# Altium project LimeSDR-Micro_mPCIe_1v4.PrjPcb (part 2 of 10)
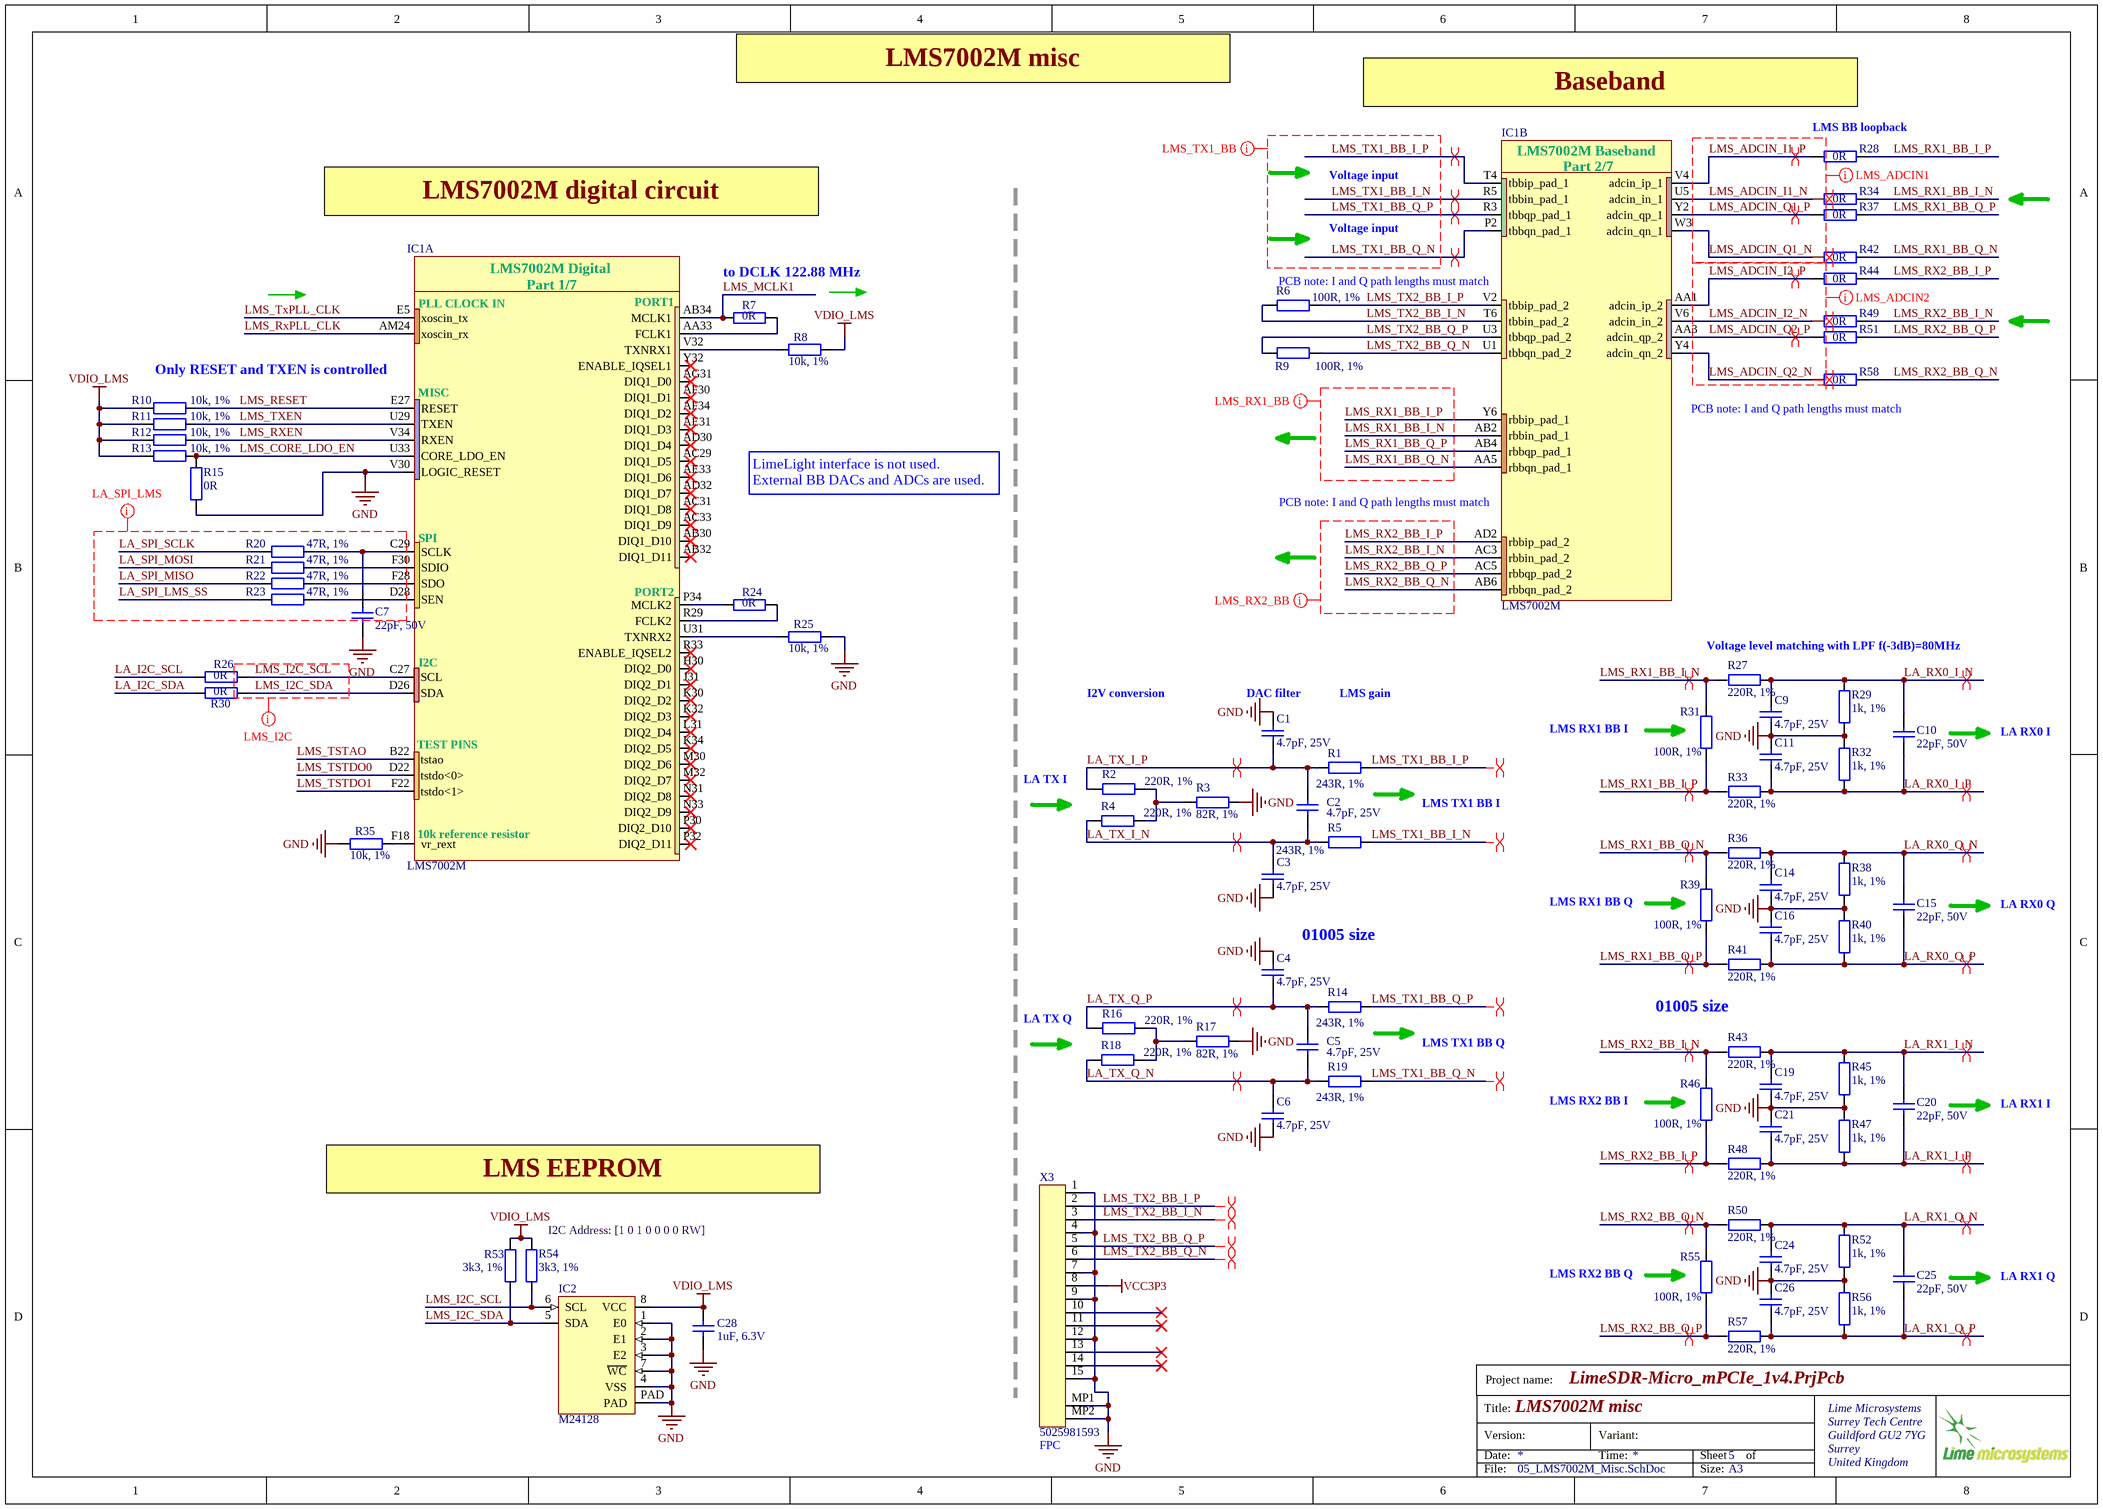
[diagram p10: 05_LMS7002M_Misc.SchDoc]

## Sheet 05_LMS7002M_Misc.SchDoc: LMS7002M misc (continued)

### Library data of the parts
C1-C4 C6 C9 = Cap_0402: Part Description: CAP CER 4.7PF 25V C0G/NP0 01005; Manufacturer: Murata; Manufacturer Part Number 1: GRM0225C1E4R7BA03L; Value: 4.7pF, 25V; Supplier 1: Digi-Key; Supplier Part Number 1: 490-13585-1-ND; Stock 1: 72879; Pricing 1: 1=0,1, 10=0,046, 50=0,0266, 100=0,0206, 500=0,0155, 1000=0,01218, 2500=0,01107, 5000=0,01019 (USD); RoHS: Yes; ComponentLink1URL: https://search.murata.co.jp/Ceramy/image/img/A01X/G101/ENG/GRM0225C1E4R7BA03-01.pdf?src-supplier=Digi-Key; ComponentLink1Description: https://search.murata.co.jp/Ceramy/image/img/A01X/G101/ENG/GRM0225C1E4R7BA03-01.pdf?src-supplier=Digi-Key; ComponentLink2URL: http://search.murata.co.jp/Ceramy/image/img/A01X/partnumbering_e_01.pdf?src-supplier=Digi-Key; ComponentLink2Description: http://search.murata.co.jp/Ceramy/image/img/A01X/partnumbering_e_01.pdf?src-supplier=Digi-Key
C5 C11 C14 C16 C19 C21 C24 C26 = Cap_0402: Manufacturer: Murata; Manufacturer Part Number 1: GRM0225C1E4R7BA03L; Part Description: CAP CER 4.7PF 25V C0G/NP0 01005; ComponentLink1Description: https://search.murata.co.jp/Ceramy/image/img/A01X/G101/ENG/GRM0225C1E4R7BA03-01.pdf?src-supplier=Digi-Key; ComponentLink1URL: https://search.murata.co.jp/Ceramy/image/img/A01X/G101/ENG/GRM0225C1E4R7BA03-01.pdf?src-supplier=Digi-Key; ComponentLink2Description: http://search.murata.co.jp/Ceramy/image/img/A01X/partnumbering_e_01.pdf?src-supplier=Digi-Key; ComponentLink2URL: http://search.murata.co.jp/Ceramy/image/img/A01X/partnumbering_e_01.pdf?src-supplier=Digi-Key; Pricing 1: 1=0,1, 10=0,046, 50=0,0266, 100=0,0206, 500=0,0155, 1000=0,01218, 2500=0,01107, 5000=0,01019 (USD); RoHS: Yes; Stock 1: 72879; Supplier 1: Digi-Key; Supplier Part Number 1: 490-13585-1-ND; Value: 4.7pF, 25V
C7 = Cap_0402: Manufacturer: Murata; Manufacturer Part Number 1: GRM0335C1H220JA01D; Part Description: 22 pF ±5% 50V Ceramic Capacitor C0G, NP0 0201 (0603 Metric); Tolerance: 5%; Dielectric: C0G; Value: 22pF, 50V; Supplier 1: Digi-Key; Supplier Part Number 1: 490-6123-1-ND; Stock 1: 2966748; Pricing 1: 1=0,10000, 10=0,01300, 50=0,00720, 100=0,00590, 500=0,00424, 1000=0,00333, 2500=0,00303, 5000=0,00279 (USD); RoHS: Yes; Mount: Surface Mount; Case/Package: 0201; Case Code (Metric): 0603; Case Code (Imperial): 0201; Min Operating Temperature: -55°C; Max Operating Temperature: 125°C; Package Quantity: 15000; Capacitance: 22pF; Voltage Rating: 50V; Packaging: Tape and Reel; Termination: SMD/SMT; Voltage: 50V; Voltage Rating (DC): 50V; Series: GRM; Length: 0.6mm; Width: 0.012inch; Height: 0.3mm; Thickness: 0.013inch; Depth: 0.3mm; Lead Free: Lead Free; RoHS Compliant: Yes; ComponentLink1URL: https://datasheet.ciiva.com/6271/partnumbering-e-01-6271146.pdf?src-supplier=Digi-Key; ComponentLink1Description: https://datasheet.ciiva.com/6271/partnumbering-e-01-6271146.pdf?src-supplier=Digi-Key; ComponentLink2URL: https://datasheet.ciiva.com/6271/partnumbering-e-01-6271143.pdf?src-supplier=Digi-Key; ComponentLink2Description: https://datasheet.ciiva.com/6271/partnumbering-e-01-6271143.pdf?src-supplier=Digi-Key; ComponentLink3URL: https://datasheet.ciiva.com/6271/partnumbering-e-01-6271149.pdf?src-supplier=Digi-Key; ComponentLink3Description: https://datasheet.ciiva.com/6271/partnumbering-e-01-6271149.pdf?src-supplier=Digi-Key
C10 = Cap_0402: Part Description: 22pF ±5% 50V C0G, NP0 Ceramic Capacitor -55°C ~ 125°C Surface Mount, MLCC 0402 (1005 Metric) 0.039" L x 0.020" W (1.00mm x 0.50mm); Manufacturer: Murata; Manufacturer Part Number 1: GRM0225C1H220JA02L; Dielectric: C0G; Tolerance: 5%; Value: 22pF, 50V; Supplier 1: Digi-Key; Supplier Part Number 1: 490-GRM0225C1H220JA02LCT-ND; Stock 1: 33525; Pricing 1: 1=0,1, 10=0,028, 50=0,016, 100=0,0125, 500=0,00938, 1000=0,00736, 2500=0,0067, 5000=0,00616 (USD); RoHS: Yes; Voltage Rating (DC): 50V; Capacitance: 22pF; Length: 400um; Width: 200um; Thickness: 200um; RoHS Compliant: Yes
C15 C20 C25 = Cap_0402: Manufacturer: Murata; Manufacturer Part Number 1: GRM0225C1H220JA02L; Part Description: 22pF ±5% 50V C0G, NP0 Ceramic Capacitor -55°C ~ 125°C Surface Mount, MLCC 0402 (1005 Metric) 0.039" L x 0.020" W (1.00mm x 0.50mm); Dielectric: C0G; Tolerance: 5%; Capacitance: 22pF; Length: 400um; Pricing 1: 1=0,1, 10=0,028, 50=0,016, 100=0,0125, 500=0,00938, 1000=0,00736, 2500=0,0067, 5000=0,00616 (USD); RoHS: Yes; RoHS Compliant: Yes; Stock 1: 33525; Supplier 1: Digi-Key; Supplier Part Number 1: 490-GRM0225C1H220JA02LCT-ND; Thickness: 200um; Value: 22pF, 50V; Voltage Rating (DC): 50V; Width: 200um
C28 = Cap_0402: Manufacturer: TDK Corporation; Manufacturer Part Number 1: JMK063ABJ105MP-F; Part Description: 1µF ±20% 6.3V X5R Ceramic Capacitor -55°C ~ 85°C Surface Mount, MLCC 0201 (0603 Metric) 0.024" L x 0.012" W (0.60mm x 0.30mm); Value: 1uF, 20%; Tolerance: ±20%; Capacitance: 1.0µF; Temperature Coefficient: X5R; Supplier 1: Digi-Key; Supplier Part Number 1: 587-5864-2-ND; Applications: General Purpose; Features: -; Lead Style: -; Ratings: -; Thickness (Max): -; Lead Spacing: -; Height - Seated (Max): -; Size / Dimension: 0.024" L x 0.012" W (0.60mm x 0.30mm); Mounting Type: Surface Mount, MLCC; Operating Temperature: -55°C ~ 85°C; Package / Case: 0201 (0603 Metric); Packaging: Cut Tape (CT); Voltage - Rated: 6.3V; Category: Capacitors; RoHS: RoHS Compliant
IC1 = LMS7002Mr4: Schematic symbol revision 4. Default footprint - 0.31mm pad; Manufacturer: Lime Microsystems; Part Description: IC FPRF Transceiver LMS7002M; 261 pin aQFN; Supplier 1: Lime Microsystems; Supplier Part Number 1: LMS7002M; Manufacturer Part Number 1: LMS7002M
IC2 = M24128-DFMC6TG: Manufacturer: STMicroelectronics; Part Description: EEPROM Memory IC 128Kb (16K x 8) I²C 1MHz 450ns 8-UFDFPN (2x3); Memory Type: Non-Volatile; Memory Format: EEPROM; Memory Size: 128Kb (16K x 8); Write Cycle Time - Word, Page: 5ms; Memory Interface: I²C; Voltage - Supply: 1.7 V ~ 5.5 V; Supplier 1: Digi-Key; Manufacturer Part Number 1: M24128-DFMC6TG; RoHS: RoHS Compliant; Category: Integrated Circuits (ICs); Stock 1: 5894; Pricing 1: 1=0.35, 10=0.348, 100=0.2854, 500=0.27748, 1000=0.27004 (USD); Packaging: Cut Tape (CT); Part Status: Active; Technology: EEPROM; Operating Temperature: -40°C ~ 85°C (TA); Mounting Type: Surface Mount; Package / Case: 8-UFDFN Exposed Pad; Supplier Device Package: 8-UFDFPN (2x3); ComponentLink1URL: http://www.st.com/content/ccc/resource/technical/document/datasheet/59/05/c9/5b/7b/41/48/b6/CD00259167.pdf/files/CD00259167.pdf/jcr:content/translations/en.CD00259167.pdf; ComponentLink1Description: http://www.st.com/content/ccc/resource/technical/document/datasheet/59/05/c9/5b/7b/41/48/b6/CD00259167.pdf/files/CD00259167.pdf/jcr:content/translations/en.CD00259167.pdf; Supplier Part Number 1: 497-15739-1-ND
R1 R5 R14 R19 = Res_0402: Part Description: RES 243 OHM 1% 1/32W 01005; Manufacturer: Yageo; Manufacturer Part Number 1: RC0100FR-07243RL; ComponentLink1URL: http://www.yageo.com/documents/recent/PYu-RC_Group_51_RoHS_L_7.pdf; ComponentLink1Description: http://www.yageo.com/documents/recent/PYu-RC_Group_51_RoHS_L_7.pdf; ComponentLink2URL: https://datasheet.ciiva.com/2560/pyu-r-int-thick-7-2560866.pdf?src-supplier=Digi-Key; ComponentLink2Description: https://datasheet.ciiva.com/2560/pyu-r-int-thick-7-2560866.pdf?src-supplier=Digi-Key; ComponentLink3URL: https://datasheet.ciiva.com/2560/pyu-r-int-thick-7-2560867.pdf?src-supplier=Digi-Key; ComponentLink3Description: https://datasheet.ciiva.com/2560/pyu-r-int-thick-7-2560867.pdf?src-supplier=Digi-Key; ComponentLink4URL: https://datasheet.ciiva.com/2560/pyu-r-int-thick-7-2560865.pdf?src-supplier=Digi-Key; ComponentLink4Description: https://datasheet.ciiva.com/2560/pyu-r-int-thick-7-2560865.pdf?src-supplier=Digi-Key; ComponentLink5URL: https://datasheet.ciiva.com/8887/pyu-rc0201-51-rohs-l-8-8887865.pdf?src-supplier=Avnet; ComponentLink5Description: https://datasheet.ciiva.com/8887/pyu-rc0201-51-rohs-l-8-8887865.pdf?src-supplier=Avnet; ComponentLink6Description: https://datasheet.ciiva.com/2471/pyu-rc0100-51-rohs-l-0-2471973.pdf?src-supplier=Digi-Key; ComponentLink6URL: https://datasheet.ciiva.com/2471/pyu-rc0100-51-rohs-l-0-2471973.pdf?src-supplier=Digi-Key; ComponentLink7Description: https://datasheet.ciiva.com/2471/pyu-rc0100-51-rohs-l-0-2471974.pdf?src-supplier=Digi-Key; ComponentLink7URL: https://datasheet.ciiva.com/2471/pyu-rc0100-51-rohs-l-0-2471974.pdf?src-supplier=Digi-Key; ComponentLink8Description: https://datasheet.ciiva.com/2471/pyu-rc0100-51-rohs-l-0-2471975.pdf?src-supplier=Digi-Key; ComponentLink8URL: https://datasheet.ciiva.com/2471/pyu-rc0100-51-rohs-l-0-2471975.pdf?src-supplier=Digi-Key; Value: 243R, 1%; Supplier 1: Digi-Key; Supplier Part Number 1: YAG6284CT-ND; Stock 1: 13300; Pricing 1: 1=0,24, 10=0,126, 50=0,0866, 100=0,0746, 500=0,05474, 1000=0,0485, 5000=0,03793, 10000=0,0347 (USD); RoHS: Yes; ComponentLink9URL: https://datasheet.octopart.com/RC0100FR-07243RL-Yageo-datasheet-164759695.pdf?src-supplier=Future+Electronics; ComponentLink9Description: https://datasheet.octopart.com/RC0100FR-07243RL-Yageo-datasheet-164759695.pdf?src-supplier=Future+Electronics; ComponentLink10URL: http://www.yageo.com.tw/exep/pages/download/literatures/PYu-R_INT-thick_7.pdf?src-supplier=Digi-Key; ComponentLink10Description: http://www.yageo.com.tw/exep/pages/download/literatures/PYu-R_INT-thick_7.pdf?src-supplier=Digi-Key; ComponentLink11URL: https://www.yageo.com/upload/media/product/productsearch/datasheet/rchip/PYu-RC_Group_51_RoHS_L_11.pdf?src-supplier=Digi-Key; ComponentLink11Description: https://www.yageo.com/upload/media/product/productsearch/datasheet/rchip/PYu-RC_Group_51_RoHS_L_11.pdf?src-supplier=Digi-Key
R2 R27 = Res_0402: Part Description: 220 Ohms ±1% 0.03W, 1/32W Chip Resistor 01005 (0402 Metric) Moisture Resistant Thick Film; Manufacturer: Yageo; Manufacturer Part Number 1: RC0100FR-07220RL; Max Power Dissipation: 30mW; Temperature Coefficient: 200ppm/°C; Value: 220R, 1%; Case Code (Imperial): 1005; Case Code (Metric): 0402; ComponentLink1Description: http://www.yageo.com.tw/exep/pages/download/literatures/PYu-R_INT-thick_7.pdf?src-supplier=Digi-Key; ComponentLink1URL: http://www.yageo.com.tw/exep/pages/download/literatures/PYu-R_INT-thick_7.pdf?src-supplier=Digi-Key; ComponentLink2Description: http://www.yageo.com/NewPortal/yageodocoutput?fileName=/pdf/R-Chip/PYu-RC_51_RoHS_P_0.pdf&src-supplier=Digi-Key; ComponentLink2URL: http://www.yageo.com/NewPortal/yageodocoutput?fileName=/pdf/R-Chip/PYu-RC_51_RoHS_P_0.pdf&src-supplier=Digi-Key; ComponentLink3Description: https://datasheet.ciiva.com/11819/0900766b80c66297-11819479.pdf?src-supplier=RSComponents; ComponentLink3URL: https://datasheet.ciiva.com/11819/0900766b80c66297-11819479.pdf?src-supplier=RSComponents; ComponentLink4Description: https://datasheet.ciiva.com/2519/pyu-r-int-thick-7-2519001.pdf?src-supplier=Digi-Key; ComponentLink4URL: https://datasheet.ciiva.com/2519/pyu-r-int-thick-7-2519001.pdf?src-supplier=Digi-Key; ComponentLink5Description: https://datasheet.ciiva.com/2519/pyu-r-int-thick-7-2519002.pdf?src-supplier=Digi-Key; ComponentLink5URL: https://datasheet.ciiva.com/2519/pyu-r-int-thick-7-2519002.pdf?src-supplier=Digi-Key; ComponentLink6Description: https://datasheet.ciiva.com/2519/pyu-r-int-thick-7-2519000.pdf?src-supplier=Digi-Key; ComponentLink6URL: https://datasheet.ciiva.com/2519/pyu-r-int-thick-7-2519000.pdf?src-supplier=Digi-Key; ComponentLink7Description: https://datasheet.ciiva.com/7849/1018594-7849983.pdf?src-supplier=Element14; ComponentLink7URL: https://datasheet.ciiva.com/7849/1018594-7849983.pdf?src-supplier=Element14; ComponentLink8Description: https://datasheet.ciiva.com/7849/1018594-7849982.pdf?src-supplier=Element14; ComponentLink8URL: https://datasheet.ciiva.com/7849/1018594-7849982.pdf?src-supplier=Element14; ComponentLink9Description: https://datasheet.ciiva.com/8889/pyu-rc0402-51-rohs-l-6-8889306.pdf?src-supplier=Avnet; ComponentLink9URL: https://datasheet.ciiva.com/8889/pyu-rc0402-51-rohs-l-6-8889306.pdf?src-supplier=Avnet; ComponentLink10Description: https://datasheet.ciiva.com/16741/pyu-rc0402-51-rohs-l-6-r-16741016.pdf?src-supplier=Future+Electronics; ComponentLink10URL: https://datasheet.ciiva.com/16741/pyu-rc0402-51-rohs-l-6-r-16741016.pdf?src-supplier=Future+Electronics; ComponentLink11Description: https://datasheet.ciiva.com/15189/getdatasheetpartid-325130-15189445.pdf?src-supplier=Verical; ComponentLink11URL: https://datasheet.ciiva.com/15189/getdatasheetpartid-325130-15189445.pdf?src-supplier=Verical; ComponentLink12Description: https://datasheet.ciiva.com/22730/1678782-22730431.pdf?src-supplier=Element14; ComponentLink12URL: https://datasheet.ciiva.com/22730/1678782-22730431.pdf?src-supplier=Element14; ComponentLink13Description: https://datasheet.ciiva.com/24056/aoa0000ce2-24056777.pdf?src-supplier=Mouser; ComponentLink13URL: https://datasheet.ciiva.com/24056/aoa0000ce2-24056777.pdf?src-supplier=Mouser; Features: Moisture Resistant; Height: 0.006inch; Length: 0.016inch; Max Operating Temperature: 125°C; Min Operating Temperature: -55°C; Number of Terminations: 2; Packaging: Tape and Reel; Pricing 1: 1=0,24, 10=0,126, 50=0,0866, 100=0,0746, 500=0,05474, 1000=0,0485, 5000=0,03793, 10000=0,0347 (USD); Resistance: 220R; RoHS: Yes; RoHS Compliant: Yes; Series: RC; Stock 1: 17268; Supplier 1: Digi-Key; Supplier Part Number 1: YAG6275CT-ND; Tolerance: 1%; Width: 0.008inch
R3 R17 = Res_0402: Part Description: RES SMD 82 OHM 1% 1/32W 01005; Manufacturer: Cyntec; Manufacturer Part Number 1: PFR02S-820-FNH; Value: 82R, 1%; Supplier 1: DigiKey; Supplier Part Number 1: 2037-PFR02S-820-FNHCT-ND; Stock 1: 53991; Pricing 1: 1=0,1, 10=0,024, 50=0,015, 100=0,0125, 500=0,00848, 1000=0,00731, 5000=0,00531, 10000=0,00471 (USD)
R4 R16 R18 R33 R36 R41 R43 R48 R50 R57 = Res_0402: Manufacturer: Yageo; Manufacturer Part Number 1: RC0100FR-07220RL; Part Description: 220 Ohms ±1% 0.03W, 1/32W Chip Resistor 01005 (0402 Metric) Moisture Resistant Thick Film; Max Power Dissipation: 30mW; Temperature Coefficient: 200ppm/°C; Case Code (Imperial): 1005; Case Code (Metric): 0402; Features: Moisture Resistant; Height: 0.006inch; Length: 0.016inch; Max Operating Temperature: 125°C; Min Operating Temperature: -55°C; Number of Terminations: 2; Packaging: Tape and Reel; Pricing 1: 1=0,24, 10=0,126, 50=0,0866, 100=0,0746, 500=0,05474, 1000=0,0485, 5000=0,03793, 10000=0,0347 (USD); Resistance: 220R; RoHS: Yes; RoHS Compliant: Yes; Series: RC; Stock 1: 17268; Supplier 1: Digi-Key; Supplier Part Number 1: YAG6275CT-ND; Tolerance: 1%; Value: 220R, 1%; Width: 0.008inch; ComponentLink1Description: http://www.yageo.com.tw/exep/pages/download/literatures/PYu-R_INT-thick_7.pdf?src-supplier=Digi-Key; ComponentLink1URL: http://www.yageo.com.tw/exep/pages/download/literatures/PYu-R_INT-thick_7.pdf?src-supplier=Digi-Key; ComponentLink2Description: http://www.yageo.com/NewPortal/yageodocoutput?fileName=/pdf/R-Chip/PYu-RC_51_RoHS_P_0.pdf&src-supplier=Digi-Key; ComponentLink2URL: http://www.yageo.com/NewPortal/yageodocoutput?fileName=/pdf/R-Chip/PYu-RC_51_RoHS_P_0.pdf&src-supplier=Digi-Key; ComponentLink3Description: https://datasheet.ciiva.com/11819/0900766b80c66297-11819479.pdf?src-supplier=RSComponents; ComponentLink3URL: https://datasheet.ciiva.com/11819/0900766b80c66297-11819479.pdf?src-supplier=RSComponents; ComponentLink4Description: https://datasheet.ciiva.com/2519/pyu-r-int-thick-7-2519001.pdf?src-supplier=Digi-Key; ComponentLink4URL: https://datasheet.ciiva.com/2519/pyu-r-int-thick-7-2519001.pdf?src-supplier=Digi-Key; ComponentLink5Description: https://datasheet.ciiva.com/2519/pyu-r-int-thick-7-2519002.pdf?src-supplier=Digi-Key; ComponentLink5URL: https://datasheet.ciiva.com/2519/pyu-r-int-thick-7-2519002.pdf?src-supplier=Digi-Key; ComponentLink6Description: https://datasheet.ciiva.com/2519/pyu-r-int-thick-7-2519000.pdf?src-supplier=Digi-Key; ComponentLink6URL: https://datasheet.ciiva.com/2519/pyu-r-int-thick-7-2519000.pdf?src-supplier=Digi-Key; ComponentLink7Description: https://datasheet.ciiva.com/7849/1018594-7849983.pdf?src-supplier=Element14; ComponentLink7URL: https://datasheet.ciiva.com/7849/1018594-7849983.pdf?src-supplier=Element14; ComponentLink8Description: https://datasheet.ciiva.com/7849/1018594-7849982.pdf?src-supplier=Element14; ComponentLink8URL: https://datasheet.ciiva.com/7849/1018594-7849982.pdf?src-supplier=Element14; ComponentLink9Description: https://datasheet.ciiva.com/8889/pyu-rc0402-51-rohs-l-6-8889306.pdf?src-supplier=Avnet; ComponentLink9URL: https://datasheet.ciiva.com/8889/pyu-rc0402-51-rohs-l-6-8889306.pdf?src-supplier=Avnet; ComponentLink10Description: https://datasheet.ciiva.com/16741/pyu-rc0402-51-rohs-l-6-r-16741016.pdf?src-supplier=Future+Electronics; ComponentLink10URL: https://datasheet.ciiva.com/16741/pyu-rc0402-51-rohs-l-6-r-16741016.pdf?src-supplier=Future+Electronics; ComponentLink11Description: https://datasheet.ciiva.com/15189/getdatasheetpartid-325130-15189445.pdf?src-supplier=Verical; ComponentLink11URL: https://datasheet.ciiva.com/15189/getdatasheetpartid-325130-15189445.pdf?src-supplier=Verical; ComponentLink12Description: https://datasheet.ciiva.com/22730/1678782-22730431.pdf?src-supplier=Element14; ComponentLink12URL: https://datasheet.ciiva.com/22730/1678782-22730431.pdf?src-supplier=Element14; ComponentLink13Description: https://datasheet.ciiva.com/24056/aoa0000ce2-24056777.pdf?src-supplier=Mouser; ComponentLink13URL: https://datasheet.ciiva.com/24056/aoa0000ce2-24056777.pdf?src-supplier=Mouser
R6 = Res_0402: Part Description: 100 Ohms ±1% 0.05W, 1/20W Chip Resistor 0201 (0603 Metric) Moisture Resistant Thick Film; Manufacturer: Yageo; Manufacturer Part Number 1: RC0201FR-07100RL; Max Power Dissipation: 50mW; Temperature Coefficient: 200ppm/°C; Voltage Rating: 25V; ComponentLink1URL: http://www.yageo.com/documents/recent/PYu-RC_Group_51_RoHS_L_7.pdf; ComponentLink1Description: http://www.yageo.com/documents/recent/PYu-RC_Group_51_RoHS_L_7.pdf; Value: 100R, 1%; ComponentLink2URL: https://datasheet.ciiva.com/2560/pyu-r-int-thick-7-2560866.pdf?src-supplier=Digi-Key; ComponentLink2Description: https://datasheet.ciiva.com/2560/pyu-r-int-thick-7-2560866.pdf?src-supplier=Digi-Key; ComponentLink3URL: https://datasheet.ciiva.com/2560/pyu-r-int-thick-7-2560867.pdf?src-supplier=Digi-Key; ComponentLink3Description: https://datasheet.ciiva.com/2560/pyu-r-int-thick-7-2560867.pdf?src-supplier=Digi-Key; ComponentLink4URL: https://datasheet.ciiva.com/2560/pyu-r-int-thick-7-2560865.pdf?src-supplier=Digi-Key; ComponentLink4Description: https://datasheet.ciiva.com/2560/pyu-r-int-thick-7-2560865.pdf?src-supplier=Digi-Key; ComponentLink5URL: https://datasheet.ciiva.com/8887/pyu-rc0201-51-rohs-l-8-8887865.pdf?src-supplier=Avnet; ComponentLink5Description: https://datasheet.ciiva.com/8887/pyu-rc0201-51-rohs-l-8-8887865.pdf?src-supplier=Avnet; Supplier 1: Digi-Key; Supplier Part Number 1: 311-100MCT-ND; Stock 1: 1625377; Pricing 1: 1=0,10000, 10=0,03700, 100=0,01530, 1000=0,00685, 2500=0,00595, 5000=0,00491 (USD); RoHS: Yes; Case/Package: 0201; Case Code (Imperial): 0201; Case Code (Metric): 0603; Contact Plating: Tin,Matte; Features: Moisture Resistant; Height: 0.01inch; Lead Free: Lead Free; Length: 0.024inch; Max Operating Temperature: 125°C; Min Operating Temperature: -55°C; Number of Terminations: 2; Package Quantity: 1; Packaging: Cut Tape; Power Rating: 50mW; Radiation Hardening: No; Resistance: 100R; Resistance Tolerance: 1%; Resistor Type: Thick Film; RoHS Compliant: Yes; Series: RC; Size Code: 0201; Termination: SMD/SMT; Tolerance: 1%; Width: 0.012inch
R7 R24 R26 R30 = Res_0402: Part Description: 0 Ohms Jumper Chip Resistor 0201 (0603 Metric) Moisture Resistant Thick Film; Manufacturer: Yageo; Manufacturer Part Number 1: RC0201JR-070RL; Power Rating: 50mW; Tolerance: 5%; Voltage Rating: 25V; ComponentLink1URL: http://www.yageo.com/documents/recent/PYu-RC_Group_51_RoHS_L_7.pdf; ComponentLink1Description: http://www.yageo.com/documents/recent/PYu-RC_Group_51_RoHS_L_7.pdf; Value: 0R; Supplier 1: Digi-Key; Supplier Part Number 1: 311-0.0NCT-ND; Stock 1: 6252381; Pricing 1: 1=0,10000, 10=0,03700, 25=0,02680, 50=0,02020, 100=0,01500, 250=0,01140, 500=0,00912, 1000=0,00672, 5000=0,00482 (USD); RoHS: Yes; Case/Package: 0201; Case Code (Metric): 0603; Case Code (Imperial): 0201; Weight: 6E-06oz; Contact Plating: Tin,Matte; Size Code: 0201; Min Operating Temperature: -55°C; Max Operating Temperature: 125°C; Packaging: Tape and Reel; Resistance: 0R; Package Quantity: 1; Resistor Type: Thick Film; Number of Terminations: 2; Termination: SMD/SMT; Max Power Dissipation: 50mW; Voltage Rating (DC): 25V; Features: Moisture Resistant; Series: RC; Construction: Rectangular; Resistance Tolerance: 5%; Length: 0.024inch; Width: 0.012inch; Height: 0.01inch; Depth: 0.3mm; Radiation Hardening: No; Military Standard: Not; Lead Free: Lead Free; RoHS Compliant: Yes; ComponentLink2URL: https://datasheet.ciiva.com/7672/1563626-7672248.pdf?src-supplier=Element14; ComponentLink2Description: https://datasheet.ciiva.com/7672/1563626-7672248.pdf?src-supplier=Element14; ComponentLink3URL: https://datasheet.ciiva.com/7672/1563626-7672247.pdf?src-supplier=Element14; ComponentLink3Description: https://datasheet.ciiva.com/7672/1563626-7672247.pdf?src-supplier=Element14; ComponentLink4URL: https://datasheet.ciiva.com/7660/1421516-7660808.pdf?src-supplier=Element14; ComponentLink4Description: https://datasheet.ciiva.com/7660/1421516-7660808.pdf?src-supplier=Element14; ComponentLink5URL: https://datasheet.ciiva.com/46391/1421516-46391340.pdf?src-supplier=Element14; ComponentLink5Description: https://datasheet.ciiva.com/46391/1421516-46391340.pdf?src-supplier=Element14
R8 R10-R13 R25 R35 = Res_0402: Manufacturer: Yageo; Manufacturer Part Number 1: RC0201FR-0710KL; Part Description: 10 kOhms ±1% 0.05W, 1/20W Chip Resistor 0201 (0603 Metric) Moisture Resistant Thick Film; Resistance: 10kR; Power Rating: 50mW; Voltage Rating: 25V; Temperature Coefficient: 200ppm/°C; Value: 10k, 1%; ComponentLink1URL: https://datasheet.ciiva.com/5924/1563626-5924912.pdf?src-supplier=Farnell; ComponentLink1Description: https://datasheet.ciiva.com/5924/1563626-5924912.pdf?src-supplier=Farnell; ComponentLink2URL: https://datasheet.ciiva.com/22661/1563626-22661319.pdf?src-supplier=Element14; ComponentLink2Description: https://datasheet.ciiva.com/22661/1563626-22661319.pdf?src-supplier=Element14; Supplier 1: Digi-Key; Supplier Part Number 1: 311-10.0KMCT-ND; Stock 1: 17142315; Pricing 1: 1=0,10000, 10=0,03700, 100=0,01530, 1000=0,00685, 2500=0,00595, 5000=0,00491 (USD); RoHS: Yes; Case/Package: 0201; Number of Pins: 2; Case Code (Imperial): 0201; Case Code (Metric): 0603; Contact Plating: Tin,Matte; Weight: 6E-06oz; Min Operating Temperature: -55°C; Max Operating Temperature: 125°C; Tolerance: 1%; Packaging: Tape and Reel; Package Quantity: 10000; Termination: SMD/SMT; Resistor Type: Thick Film; Number of Terminations: 2; Max Power Dissipation: 50mW; Voltage Rating (DC): 25V; Features: Moisture Resistant; Series: RC; Resistance Tolerance: 1%; Construction: Rectangular; Working Voltage: 25V; Technology: THICK FILM; Length: 0.6mm; Width: 0.012inch; Height: 0.01inch; Depth: 0.3mm; Radiation Hardening: No; Reach SVHC Compliant: Yes; Military Standard: Not; Lead Free: Lead Free; RoHS Compliant: Yes; ComponentLink3URL: https://datasheet.ciiva.com/7660/1421516-7660807.pdf?src-supplier=Element14; ComponentLink3Description: https://datasheet.ciiva.com/7660/1421516-7660807.pdf?src-supplier=Element14; ComponentLink4URL: https://datasheet.ciiva.com/46391/1421516-46391339.pdf?src-supplier=Element14; ComponentLink4Description: https://datasheet.ciiva.com/46391/1421516-46391339.pdf?src-supplier=Element14; ComponentLink5URL: https://datasheet.ciiva.com/2467/pyu-r-int-thick-7-2467110.pdf?src-supplier=Digi-Key; ComponentLink5Description: https://datasheet.ciiva.com/2467/pyu-r-int-thick-7-2467110.pdf?src-supplier=Digi-Key; ComponentLink6URL: https://datasheet.ciiva.com/2467/pyu-r-int-thick-7-2467111.pdf?src-supplier=Digi-Key; ComponentLink6Description: https://datasheet.ciiva.com/2467/pyu-r-int-thick-7-2467111.pdf?src-supplier=Digi-Key; ComponentLink7URL: https://datasheet.ciiva.com/2467/pyu-r-int-thick-7-2467109.pdf?src-supplier=Digi-Key; ComponentLink7Description: https://datasheet.ciiva.com/2467/pyu-r-int-thick-7-2467109.pdf?src-supplier=Digi-Key
R9 = Res_0402: Manufacturer: Yageo; Manufacturer Part Number 1: RC0201FR-07100RL; Part Description: 100 Ohms ±1% 0.05W, 1/20W Chip Resistor 0201 (0603 Metric) Moisture Resistant Thick Film; Max Power Dissipation: 50mW; Temperature Coefficient: 200ppm/°C; Voltage Rating: 25V; ComponentLink1URL: http://www.yageo.com/documents/recent/PYu-RC_Group_51_RoHS_L_7.pdf; ComponentLink1Description: http://www.yageo.com/documents/recent/PYu-RC_Group_51_RoHS_L_7.pdf; ComponentLink2URL: https://datasheet.ciiva.com/2560/pyu-r-int-thick-7-2560866.pdf?src-supplier=Digi-Key; ComponentLink2Description: https://datasheet.ciiva.com/2560/pyu-r-int-thick-7-2560866.pdf?src-supplier=Digi-Key; ComponentLink3URL: https://datasheet.ciiva.com/2560/pyu-r-int-thick-7-2560867.pdf?src-supplier=Digi-Key; ComponentLink3Description: https://datasheet.ciiva.com/2560/pyu-r-int-thick-7-2560867.pdf?src-supplier=Digi-Key; ComponentLink4URL: https://datasheet.ciiva.com/2560/pyu-r-int-thick-7-2560865.pdf?src-supplier=Digi-Key; ComponentLink4Description: https://datasheet.ciiva.com/2560/pyu-r-int-thick-7-2560865.pdf?src-supplier=Digi-Key; ComponentLink5URL: https://datasheet.ciiva.com/8887/pyu-rc0201-51-rohs-l-8-8887865.pdf?src-supplier=Avnet; ComponentLink5Description: https://datasheet.ciiva.com/8887/pyu-rc0201-51-rohs-l-8-8887865.pdf?src-supplier=Avnet; Pricing 1: 1=0,10000, 10=0,03700, 100=0,01530, 1000=0,00685, 2500=0,00595, 5000=0,00491 (USD); RoHS: Yes; Stock 1: 1625377; Supplier 1: Digi-Key; Supplier Part Number 1: 311-100MCT-ND; Value: 100R, 1%; Case/Package: 0201; Case Code (Imperial): 0201; Case Code (Metric): 0603; Contact Plating: Tin,Matte; Features: Moisture Resistant; Height: 0.01inch; Lead Free: Lead Free; Length: 0.024inch; Max Operating Temperature: 125°C; Min Operating Temperature: -55°C; Number of Terminations: 2; Package Quantity: 1; Packaging: Cut Tape; Power Rating: 50mW; Radiation Hardening: No; Resistance: 100R; Resistance Tolerance: 1%; Resistor Type: Thick Film; RoHS Compliant: Yes; Series: RC; Size Code: 0201; Termination: SMD/SMT; Tolerance: 1%; Width: 0.012inch
R15 = Res_0402: Manufacturer Part Number 1: RC0402JR-070RL; Manufacturer: Yageo; Part Description: RES SMD 0.0OHM JUMPER 1/16W 0402; Resistance (Ohms): 0.0; Tolerance: Jumper; Power (Watts): 0.063W, 1/16W; Value: 0R; Supplier 1: Digi-Key; Supplier Part Number 1: 311-0.0JRTR-ND; Category: Resistors; Temperature Coefficient: -; Features: Moisture Resistant; Supplier Device Package: 0402; Height: 0.016" (0.40mm); Package / Case: 0402 (1005 Metric); Operating Temperature: -55°C ~ 155°C; Size / Dimension: 0.039" L x 0.020" W (1.00mm x 0.50mm); Composition: Thick Film; Packaging: Tape & Reel (TR); Number of Terminations: 2; RoHS: RoHS Compliant
R20-R23 = Res_0402: Manufacturer: Yageo; Manufacturer Part Number 1: RC0201FR-0747RL; Part Description: 47 Ohms ±1% 0.05W, 1/20W Chip Resistor 0201 (0603 Metric) Moisture Resistant Thick Film; Power Rating: 50mW; Voltage Rating: 25V; Temperature Coefficient: 200ppm/°C; Value: 47R, 1%; Supplier 1: Digi-Key; Supplier Part Number 1: YAG2694CT-ND; Stock 1: 778022; Pricing 1: 1=0,10000, 10=0,03700, 100=0,01530, 1000=0,00685, 2500=0,00595, 5000=0,00491 (USD); RoHS: Yes; Case/Package: 0201; Case Code (Imperial): 0201; Case Code (Metric): 0603; Min Operating Temperature: -55°C; Max Operating Temperature: 125°C; Packaging: Tape and Reel; Resistance: 47R; Tolerance: 1%; Resistor Type: Thick Film; Termination: SMD/SMT; Number of Terminations: 2; Max Power Dissipation: 50mW; Features: Moisture Resistant; Series: RC; Resistance Tolerance: 1%; Length: 0.6mm; Width: 0.3mm; Height: 0.23mm; Reach SVHC Compliant: Yes; RoHS Compliant: Yes; ComponentLink1URL: https://datasheet.ciiva.com/5924/1563626-5924912.pdf?src-supplier=Farnell; ComponentLink1Description: https://datasheet.ciiva.com/5924/1563626-5924912.pdf?src-supplier=Farnell; ComponentLink2URL: https://datasheet.ciiva.com/22661/1563626-22661319.pdf?src-supplier=Element14; ComponentLink2Description: https://datasheet.ciiva.com/22661/1563626-22661319.pdf?src-supplier=Element14
R28 R34 R37 R42 R44 R49 R51 R58 = Res_0402: Manufacturer: Panasonic; Manufacturer Part Number 1: ERJ-XGN0R00Y; Part Description: RES SMD 0 OHM JUMP 1/32W 01005; Max Power Dissipation: 30mW; Power Rating: 31.25mW; Resistance Tolerance: 1%; Temperature Coefficient: -100ppm/°C; Tolerance: 5%; Voltage Rating (DC): 15V; ComponentLink1URL: http://www.yageo.com/documents/recent/PYu-RC_Group_51_RoHS_L_7.pdf; ComponentLink1Description: http://www.yageo.com/documents/recent/PYu-RC_Group_51_RoHS_L_7.pdf; ComponentLink2URL: https://datasheet.ciiva.com/7672/1563626-7672248.pdf?src-supplier=Element14; ComponentLink2Description: https://datasheet.ciiva.com/7672/1563626-7672248.pdf?src-supplier=Element14; ComponentLink3Description: https://datasheet.ciiva.com/7672/1563626-7672247.pdf?src-supplier=Element14; ComponentLink3URL: https://datasheet.ciiva.com/7672/1563626-7672247.pdf?src-supplier=Element14; Case/Package: Molded; Case Code (Imperial): 1005; Case Code (Metric): 0402; ComponentLink4Description: https://datasheet.ciiva.com/7660/1421516-7660808.pdf?src-supplier=Element14; ComponentLink4URL: https://datasheet.ciiva.com/7660/1421516-7660808.pdf?src-supplier=Element14; ComponentLink5Description: https://datasheet.ciiva.com/46391/1421516-46391340.pdf?src-supplier=Element14; ComponentLink5URL: https://datasheet.ciiva.com/46391/1421516-46391340.pdf?src-supplier=Element14; ComponentLink6Description: https://datasheet.ciiva.com/5959/aoa0000ce2-5959897.pdf?src-supplier=Farnell; ComponentLink6URL: https://datasheet.ciiva.com/5959/aoa0000ce2-5959897.pdf?src-supplier=Farnell; ComponentLink7Description: https://datasheet.ciiva.com/7753/1678782-7753973.pdf?src-supplier=Element14; ComponentLink7URL: https://datasheet.ciiva.com/7753/1678782-7753973.pdf?src-supplier=Element14; ComponentLink8Description: https://datasheet.ciiva.com/22765/1678782-22765015.pdf?src-supplier=Farnell; ComponentLink8URL: https://datasheet.ciiva.com/22765/1678782-22765015.pdf?src-supplier=Farnell; ComponentLink9Description: https://datasheet.ciiva.com/22667/1678782-22667862.pdf?src-supplier=Element14; ComponentLink9URL: https://datasheet.ciiva.com/22667/1678782-22667862.pdf?src-supplier=Element14; ComponentLink10Description: https://datasheet.ciiva.com/24055/aoa0000ce1-37422-24055061.pdf?src-supplier=Mouser; ComponentLink10URL: https://datasheet.ciiva.com/24055/aoa0000ce1-37422-24055061.pdf?src-supplier=Mouser; ComponentLink11Description: https://datasheet.ciiva.com/9199/aoa0000ce1-9199022.pdf?src-supplier=Avnet; ComponentLink11URL: https://datasheet.ciiva.com/9199/aoa0000ce1-9199022.pdf?src-supplier=Avnet; ComponentLink12Description: https://datasheet.ciiva.com/30177/4aoa0000ce1-30177151.pdf?src-supplier=Onlinecomponents.com; ComponentLink12URL: https://datasheet.ciiva.com/30177/4aoa0000ce1-30177151.pdf?src-supplier=Onlinecomponents.com; ComponentLink13Description: https://datasheet.ciiva.com/29928/aoa0000ce1-29928300.pdf?src-supplier=Avnet; ComponentLink13URL: https://datasheet.ciiva.com/29928/aoa0000ce1-29928300.pdf?src-supplier=Avnet; Construction: Rectangular; Contact Plating: Tin; Depth: 0.2mm; Height: 0.006inch; Length: 0.4mm; Max Operating Temperature: 125°C; Military Standard: Not; Min Operating Temperature: -55°C; Mount: Surface Mount; Number of Pins: 2; Number of Terminations: 2; Package Quantity: 1; Packaging: Tape and Reel; Pricing 1: 1=0,16, 10=0,13, 25=0,0992, 50=0,072, 100=0,0507, 250=0,041, 500=0,0323, 1000=0,02236, 5000=0,01863 (USD); Radiation Hardening: No; Reach SVHC Compliant: Unknown; Resistance: 0R; Resistor Type: Thick Film; RoHS: Yes; RoHS Compliant: Yes; Series: ERJ; Stock 1: 2498826; Supplier 1: Digi-Key; Supplier Part Number 1: P0.0AWCT-ND; Termination: SMD/SMT; Value: 0R; Voltage Rating: 15V; Width: 0.2mm
R29 R38 = Res_0402: Part Description: RES SMD 1K OHM 1% 1/32W 01005; Manufacturer: Cyntec; Manufacturer Part Number 1: PFR02S-102-FNH; ComponentLink1URL: http://www.yageo.com.tw/exep/pages/download/literatures/PYu-R_INT-thick_7.pdf?src-supplier=Digi-Key; ComponentLink1Description: http://www.yageo.com.tw/exep/pages/download/literatures/PYu-R_INT-thick_7.pdf?src-supplier=Digi-Key; ComponentLink2URL: http://www.yageo.com/NewPortal/yageodocoutput?fileName=/pdf/R-Chip/PYu-RC_51_RoHS_P_0.pdf&src-supplier=Digi-Key; ComponentLink2Description: http://www.yageo.com/NewPortal/yageodocoutput?fileName=/pdf/R-Chip/PYu-RC_51_RoHS_P_0.pdf&src-supplier=Digi-Key; ComponentLink3URL: https://datasheet.ciiva.com/11819/0900766b80c66297-11819479.pdf?src-supplier=RSComponents; ComponentLink3Description: https://datasheet.ciiva.com/11819/0900766b80c66297-11819479.pdf?src-supplier=RSComponents; ComponentLink4URL: https://datasheet.ciiva.com/2519/pyu-r-int-thick-7-2519001.pdf?src-supplier=Digi-Key; ComponentLink4Description: https://datasheet.ciiva.com/2519/pyu-r-int-thick-7-2519001.pdf?src-supplier=Digi-Key; ComponentLink5URL: https://datasheet.ciiva.com/2519/pyu-r-int-thick-7-2519002.pdf?src-supplier=Digi-Key; ComponentLink5Description: https://datasheet.ciiva.com/2519/pyu-r-int-thick-7-2519002.pdf?src-supplier=Digi-Key; ComponentLink6URL: https://datasheet.ciiva.com/2519/pyu-r-int-thick-7-2519000.pdf?src-supplier=Digi-Key; ComponentLink6Description: https://datasheet.ciiva.com/2519/pyu-r-int-thick-7-2519000.pdf?src-supplier=Digi-Key; ComponentLink7URL: https://datasheet.ciiva.com/7849/1018594-7849983.pdf?src-supplier=Element14; ComponentLink7Description: https://datasheet.ciiva.com/7849/1018594-7849983.pdf?src-supplier=Element14; ComponentLink8URL: https://datasheet.ciiva.com/7849/1018594-7849982.pdf?src-supplier=Element14; ComponentLink8Description: https://datasheet.ciiva.com/7849/1018594-7849982.pdf?src-supplier=Element14; ComponentLink9URL: https://datasheet.ciiva.com/8889/pyu-rc0402-51-rohs-l-6-8889306.pdf?src-supplier=Avnet; ComponentLink9Description: https://datasheet.ciiva.com/8889/pyu-rc0402-51-rohs-l-6-8889306.pdf?src-supplier=Avnet; ComponentLink10URL: https://datasheet.ciiva.com/16741/pyu-rc0402-51-rohs-l-6-r-16741016.pdf?src-supplier=Future+Electronics; ComponentLink10Description: https://datasheet.ciiva.com/16741/pyu-rc0402-51-rohs-l-6-r-16741016.pdf?src-supplier=Future+Electronics; ComponentLink11URL: https://datasheet.ciiva.com/15189/getdatasheetpartid-325130-15189445.pdf?src-supplier=Verical; ComponentLink11Description: https://datasheet.ciiva.com/15189/getdatasheetpartid-325130-15189445.pdf?src-supplier=Verical; ComponentLink12Description: https://datasheet.ciiva.com/22730/1678782-22730431.pdf?src-supplier=Element14; ComponentLink12URL: https://datasheet.ciiva.com/22730/1678782-22730431.pdf?src-supplier=Element14; ComponentLink13Description: https://datasheet.ciiva.com/24056/aoa0000ce2-24056777.pdf?src-supplier=Mouser; ComponentLink13URL: https://datasheet.ciiva.com/24056/aoa0000ce2-24056777.pdf?src-supplier=Mouser; Value: 1k, 1%; Supplier 1: Digi-Key; Supplier Part Number 1: 2037-PFR02S-102-FNHCT-ND; Stock 1: 1788660; Pricing 1: 1=0,1, 10=0,024, 50=0,015, 100=0,0125, 500=0,00848, 1000=0,00731, 5000=0,00531, 10000=0,00471 (USD); RoHS: No
R31 R39 R46 R55 = Res_0402: Manufacturer: Yageo; Manufacturer Part Number 1: RC0100FR-07100RL; Part Description: 100 Ohms ±1% 0.03W, 1/32W Chip Resistor 01005 (0402 Metric) Moisture Resistant Thick Film; ComponentLink1URL: http://www.yageo.com/documents/recent/PYu-RC_Group_51_RoHS_L_7.pdf; ComponentLink1Description: http://www.yageo.com/documents/recent/PYu-RC_Group_51_RoHS_L_7.pdf; ComponentLink2URL: https://datasheet.ciiva.com/2560/pyu-r-int-thick-7-2560866.pdf?src-supplier=Digi-Key; ComponentLink2Description: https://datasheet.ciiva.com/2560/pyu-r-int-thick-7-2560866.pdf?src-supplier=Digi-Key; ComponentLink3URL: https://datasheet.ciiva.com/2560/pyu-r-int-thick-7-2560867.pdf?src-supplier=Digi-Key; ComponentLink3Description: https://datasheet.ciiva.com/2560/pyu-r-int-thick-7-2560867.pdf?src-supplier=Digi-Key; ComponentLink4URL: https://datasheet.ciiva.com/2560/pyu-r-int-thick-7-2560865.pdf?src-supplier=Digi-Key; ComponentLink4Description: https://datasheet.ciiva.com/2560/pyu-r-int-thick-7-2560865.pdf?src-supplier=Digi-Key; ComponentLink5URL: https://datasheet.ciiva.com/8887/pyu-rc0201-51-rohs-l-8-8887865.pdf?src-supplier=Avnet; ComponentLink5Description: https://datasheet.ciiva.com/8887/pyu-rc0201-51-rohs-l-8-8887865.pdf?src-supplier=Avnet; ComponentLink6Description: https://datasheet.ciiva.com/2471/pyu-rc0100-51-rohs-l-0-2471973.pdf?src-supplier=Digi-Key; ComponentLink6URL: https://datasheet.ciiva.com/2471/pyu-rc0100-51-rohs-l-0-2471973.pdf?src-supplier=Digi-Key; ComponentLink7Description: https://datasheet.ciiva.com/2471/pyu-rc0100-51-rohs-l-0-2471974.pdf?src-supplier=Digi-Key; ComponentLink7URL: https://datasheet.ciiva.com/2471/pyu-rc0100-51-rohs-l-0-2471974.pdf?src-supplier=Digi-Key; ComponentLink8Description: https://datasheet.ciiva.com/2471/pyu-rc0100-51-rohs-l-0-2471975.pdf?src-supplier=Digi-Key; ComponentLink8URL: https://datasheet.ciiva.com/2471/pyu-rc0100-51-rohs-l-0-2471975.pdf?src-supplier=Digi-Key; Pricing 1: 1=0,23, 10=0,12, 50=0,0824, 100=0,0709, 500=0,05204, 1000=0,04609, 5000=0,03606, 10000=0,03298 (USD); RoHS: Yes; Stock 1: 354906; Supplier 1: Digi-Key; Supplier Part Number 1: 311-100DGCT-ND; Value: 100R, 1%
R32 R40 R45 R47 R52 R56 = Res_0402: Manufacturer: Cyntec; Manufacturer Part Number 1: PFR02S-102-FNH; Part Description: RES SMD 1K OHM 1% 1/32W 01005; ComponentLink1URL: http://www.yageo.com.tw/exep/pages/download/literatures/PYu-R_INT-thick_7.pdf?src-supplier=Digi-Key; ComponentLink1Description: http://www.yageo.com.tw/exep/pages/download/literatures/PYu-R_INT-thick_7.pdf?src-supplier=Digi-Key; ComponentLink2URL: http://www.yageo.com/NewPortal/yageodocoutput?fileName=/pdf/R-Chip/PYu-RC_51_RoHS_P_0.pdf&src-supplier=Digi-Key; ComponentLink2Description: http://www.yageo.com/NewPortal/yageodocoutput?fileName=/pdf/R-Chip/PYu-RC_51_RoHS_P_0.pdf&src-supplier=Digi-Key; ComponentLink3URL: https://datasheet.ciiva.com/11819/0900766b80c66297-11819479.pdf?src-supplier=RSComponents; ComponentLink3Description: https://datasheet.ciiva.com/11819/0900766b80c66297-11819479.pdf?src-supplier=RSComponents; ComponentLink4URL: https://datasheet.ciiva.com/2519/pyu-r-int-thick-7-2519001.pdf?src-supplier=Digi-Key; ComponentLink4Description: https://datasheet.ciiva.com/2519/pyu-r-int-thick-7-2519001.pdf?src-supplier=Digi-Key; ComponentLink5URL: https://datasheet.ciiva.com/2519/pyu-r-int-thick-7-2519002.pdf?src-supplier=Digi-Key; ComponentLink5Description: https://datasheet.ciiva.com/2519/pyu-r-int-thick-7-2519002.pdf?src-supplier=Digi-Key; ComponentLink6URL: https://datasheet.ciiva.com/2519/pyu-r-int-thick-7-2519000.pdf?src-supplier=Digi-Key; ComponentLink6Description: https://datasheet.ciiva.com/2519/pyu-r-int-thick-7-2519000.pdf?src-supplier=Digi-Key; ComponentLink7URL: https://datasheet.ciiva.com/7849/1018594-7849983.pdf?src-supplier=Element14; ComponentLink7Description: https://datasheet.ciiva.com/7849/1018594-7849983.pdf?src-supplier=Element14; ComponentLink8URL: https://datasheet.ciiva.com/7849/1018594-7849982.pdf?src-supplier=Element14; ComponentLink8Description: https://datasheet.ciiva.com/7849/1018594-7849982.pdf?src-supplier=Element14; ComponentLink9URL: https://datasheet.ciiva.com/8889/pyu-rc0402-51-rohs-l-6-8889306.pdf?src-supplier=Avnet; ComponentLink9Description: https://datasheet.ciiva.com/8889/pyu-rc0402-51-rohs-l-6-8889306.pdf?src-supplier=Avnet; ComponentLink10URL: https://datasheet.ciiva.com/16741/pyu-rc0402-51-rohs-l-6-r-16741016.pdf?src-supplier=Future+Electronics; ComponentLink10Description: https://datasheet.ciiva.com/16741/pyu-rc0402-51-rohs-l-6-r-16741016.pdf?src-supplier=Future+Electronics; ComponentLink11URL: https://datasheet.ciiva.com/15189/getdatasheetpartid-325130-15189445.pdf?src-supplier=Verical; ComponentLink11Description: https://datasheet.ciiva.com/15189/getdatasheetpartid-325130-15189445.pdf?src-supplier=Verical; ComponentLink12Description: https://datasheet.ciiva.com/22730/1678782-22730431.pdf?src-supplier=Element14; ComponentLink12URL: https://datasheet.ciiva.com/22730/1678782-22730431.pdf?src-supplier=Element14; ComponentLink13Description: https://datasheet.ciiva.com/24056/aoa0000ce2-24056777.pdf?src-supplier=Mouser; ComponentLink13URL: https://datasheet.ciiva.com/24056/aoa0000ce2-24056777.pdf?src-supplier=Mouser; Pricing 1: 1=0,1, 10=0,024, 50=0,015, 100=0,0125, 500=0,00848, 1000=0,00731, 5000=0,00531, 10000=0,00471 (USD); RoHS: No; Stock 1: 1788660; Supplier 1: Digi-Key; Supplier Part Number 1: 2037-PFR02S-102-FNHCT-ND; Value: 1k, 1%
R53 R54 = Res_0402: Manufacturer: Yageo; Manufacturer Part Number 1: RC0201FR-073K3L; Part Description: 3.3 kOhms ±1% 0.05W, 1/20W Chip Resistor 0201 (0603 Metric) Moisture Resistant Thick Film; Max Power Dissipation: 50mW; Resistance: 3.3kR; Temperature Coefficient: 200ppm/°C; Voltage Rating: 25V; ComponentLink1URL: http://www.yageo.com/documents/recent/PYu-RC_Group_51_RoHS_L_7.pdf; ComponentLink1Description: http://www.yageo.com/documents/recent/PYu-RC_Group_51_RoHS_L_7.pdf; ComponentLink2URL: https://datasheet.ciiva.com/22698/1563626-22698524.pdf?src-supplier=Element14; ComponentLink2Description: https://datasheet.ciiva.com/22698/1563626-22698524.pdf?src-supplier=Element14; ComponentLink3URL: https://datasheet.ciiva.com/14985/pyu-r-int-thick-7-14985418.pdf?src-supplier=Digi-Key; ComponentLink3Description: https://datasheet.ciiva.com/14985/pyu-r-int-thick-7-14985418.pdf?src-supplier=Digi-Key; Case/Package: 0201; Case Code (Imperial): 0201; Case Code (Metric): 0603; Construction: Rectangular; Depth: 0.3mm; Features: Moisture Resistant; Height: 0.01inch; Length: 0.024inch; Max Operating Temperature: 125°C; Military Standard: Not; Min Operating Temperature: -55°C; Number of Terminations: 2; Package Quantity: 10000; Packaging: Tape and Reel; Power Rating: 50mW; Pricing 1: 1=0,10000, 10=0,03700, 100=0,01500, 1000=0,00672, 2500=0,00583, 5000=0,00482 (USD); Resistance Tolerance: 1%; Resistor Type: Thick Film; RoHS: Yes; RoHS Compliant: Yes; Series: RC; Stock 1: 586100; Supplier 1: Digi-Key; Supplier Part Number 1: YAG2285CT-ND; Termination: SMD/SMT; Tolerance: 1%; Value: 3k3, 1%; Width: 0.3mm
X3 = 5025981593_FPC_connector: Part Description: 15 Position FPC Connector Contacts, Top and Bottom 0.012" (0.30mm) Surface Mount, Right Angle; Manufacturer: Molex; Supplier 1: Digi-Key; Supplier Part Number 1: 900-5025981593CT-ND; Manufacturer Part Number 1: 5025981593; Stock 1: 19758; Pricing 1: 1=1,40000, 10=1,15900, 100=0,96600, 1000=0,77280 (USD); RoHS: Yes